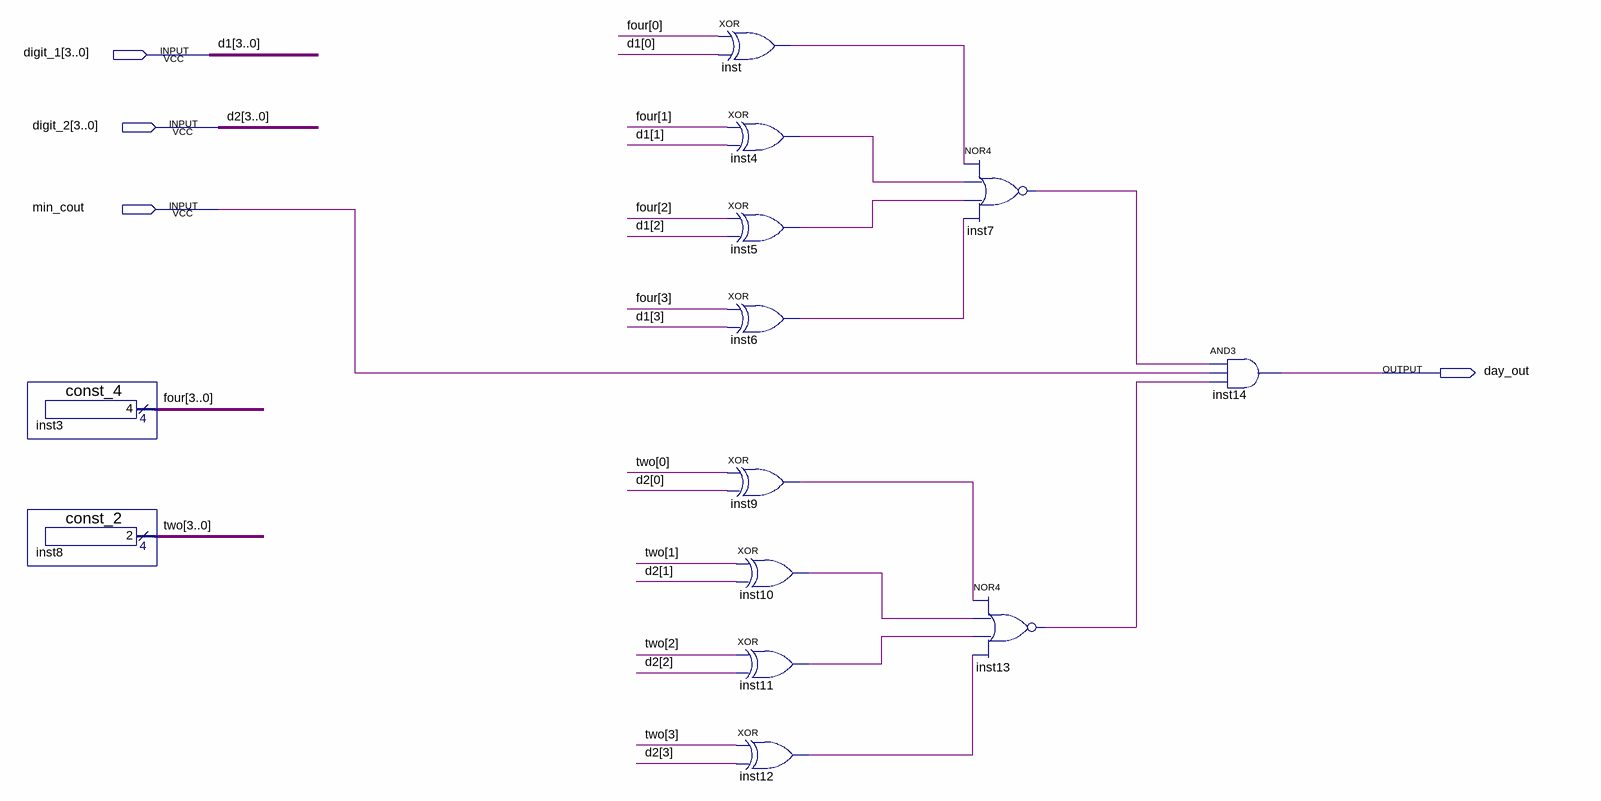
[diagram p0: schematic sheet]
// Quartus schematic new_day.bdf as structural Verilog: 13 symbols, 4 pins
module new_day (
  input  [3:0] digit_1,
  input  [3:0] digit_2,
  input  min_cout,
  output day_out
);

  wire inst4_out, inst5_out, inst6_out, inst7_out, inst9_out, inst10_out, inst11_out, inst12_out, inst13_out,
       inst_out;
  wire [3:0] four, two;

  const_4 inst3 (.result(four));
  const_2 inst8 (.result(two));
  xor inst (inst_out, four[0], digit_1[0]);
  xor inst4 (inst4_out, four[1], digit_1[1]);
  xor inst5 (inst5_out, four[2], digit_1[2]);
  xor inst6 (inst6_out, four[3], digit_1[3]);
  xor inst9 (inst9_out, two[0], digit_2[0]);
  xor inst10 (inst10_out, two[1], digit_2[1]);
  xor inst11 (inst11_out, two[2], digit_2[2]);
  xor inst12 (inst12_out, two[3], digit_2[3]);
  nor inst7 (inst7_out, inst_out, inst4_out, inst5_out, inst6_out);
  nor inst13 (inst13_out, inst9_out, inst10_out, inst11_out, inst12_out);
  and inst14 (day_out, inst7_out, min_cout, inst13_out);

  // Other names for the same wires on the sheet: d1[3:0] = digit_1; d2[3:0] = digit_2
endmodule
